# Altium project pale_sieve.PrjPcb
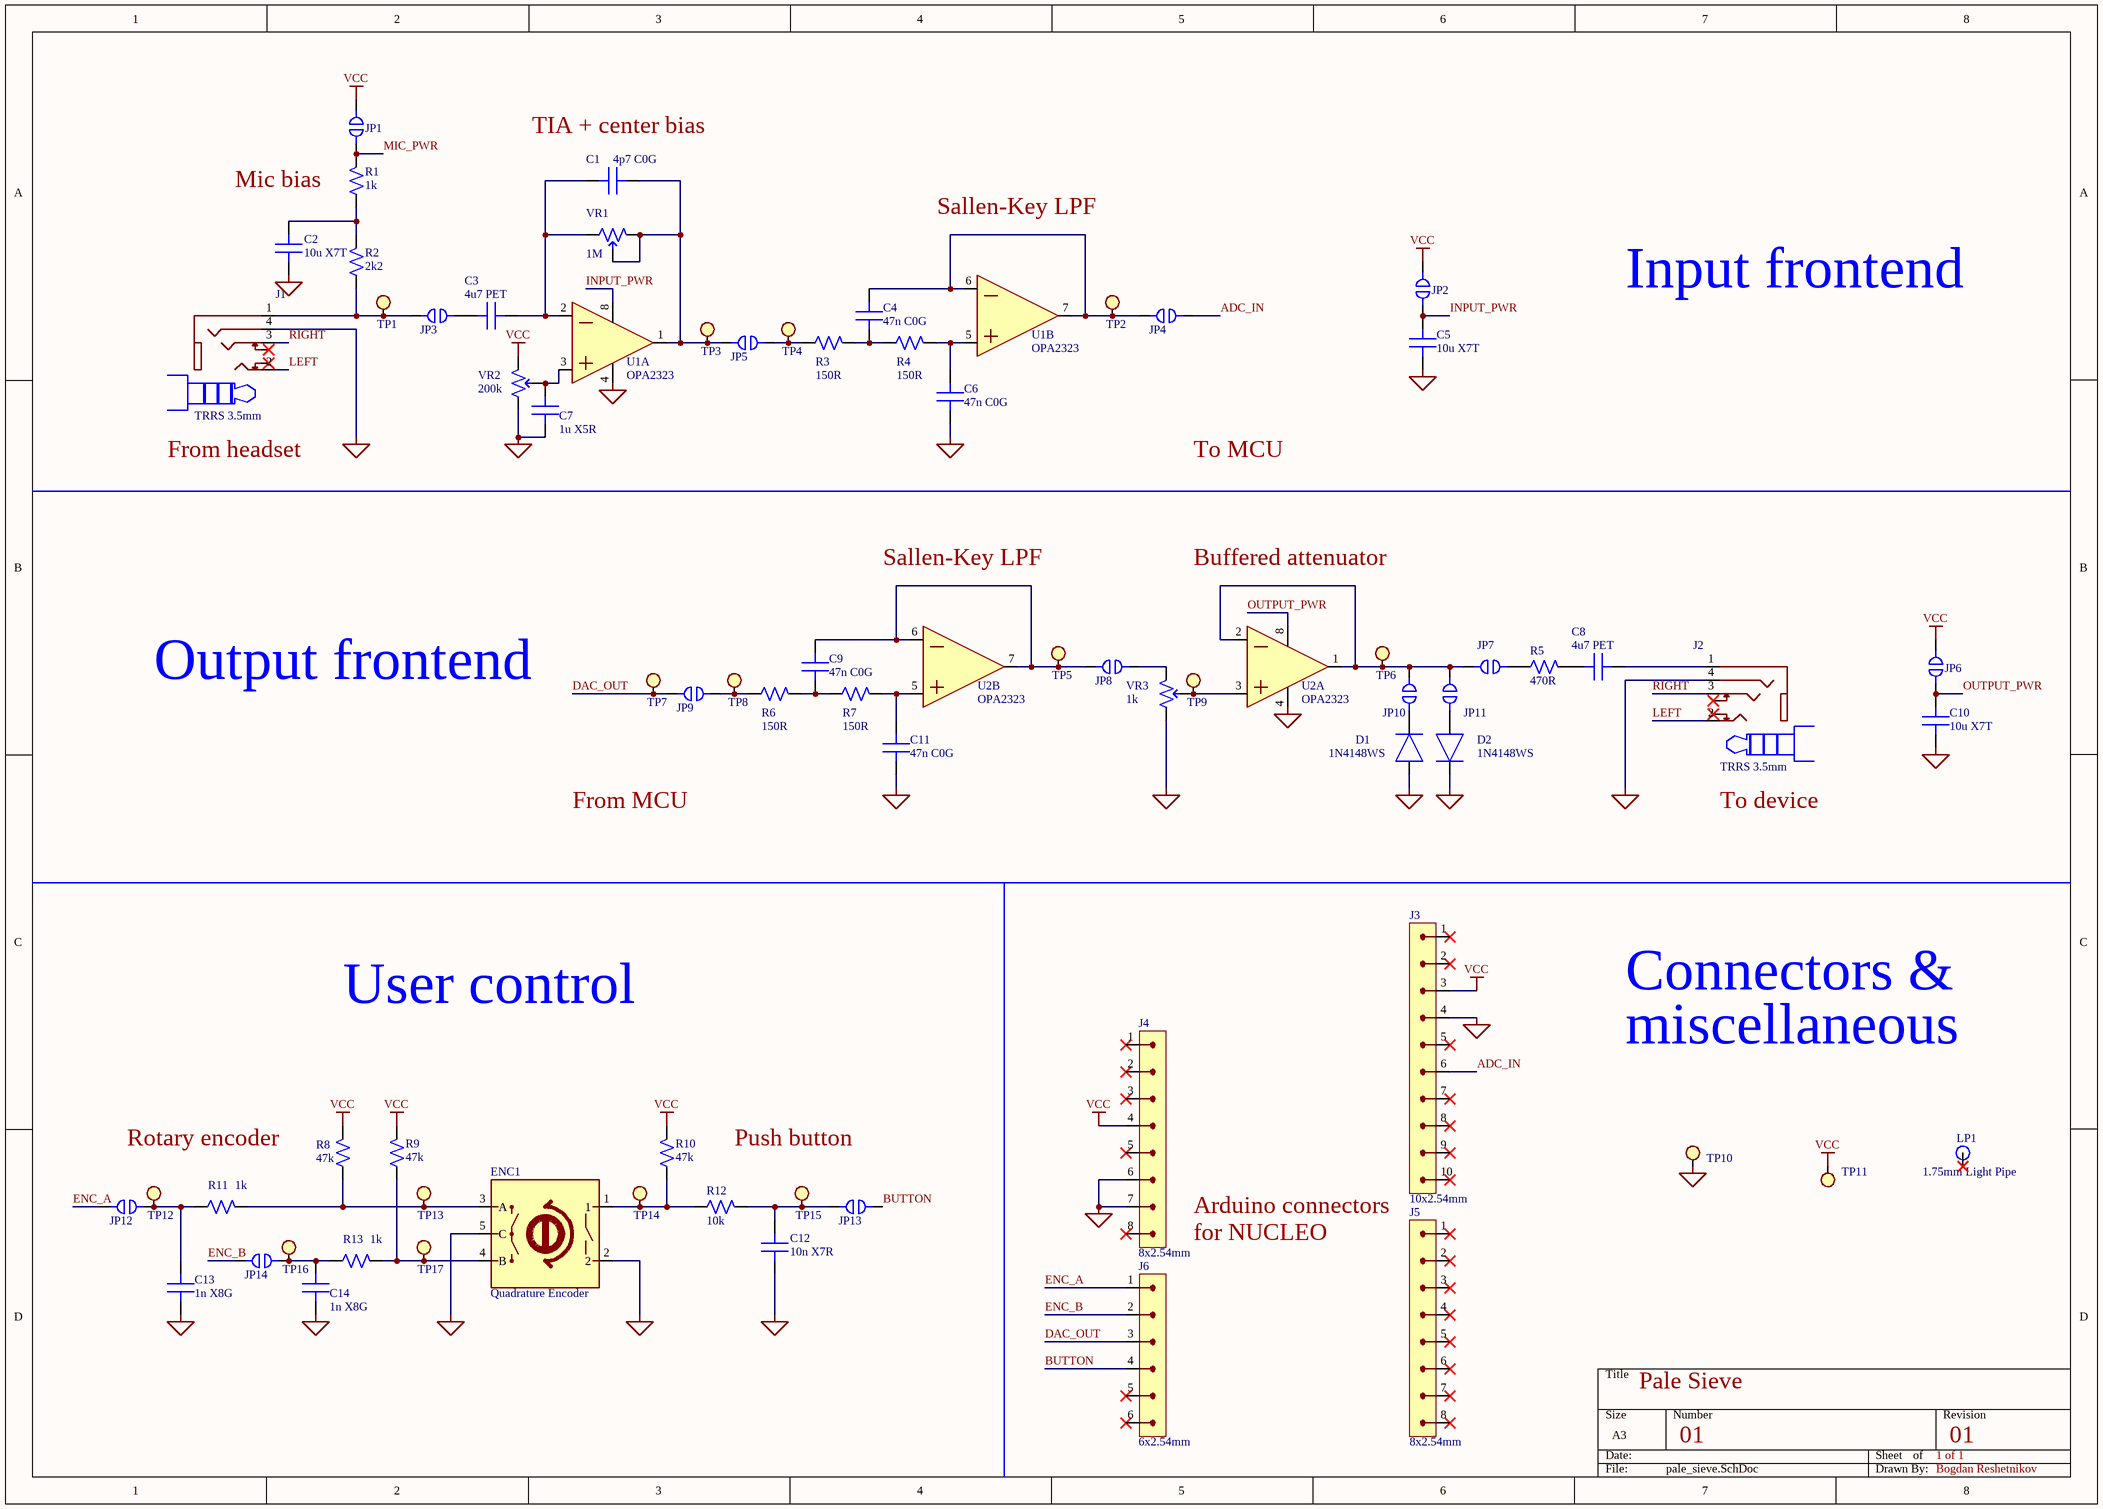
[diagram p0: pale_sieve.SchDoc]
1 sheet, 73 parts. Net scope: global (net labels, ports and power ports of the same name join across sheets).
Board file: pale_sieve.PcbDoc

## Sheet pale_sieve.SchDoc: Pale Sieve
size A3; Revision: 01; SheetNumber: 1; SheetTotal: 1

### Parts
C1  4p7 C0G  [C0603]
C2  10u X7T  [C0603]
C3  4u7 PET  [6054 WIMA]
C4  47n C0G  [C0805]
C5  10u X7T  [C0603]
C6  47n C0G  [C0805]
C7  1u X5R  [C0603]
C8  4u7 PET  [6054 WIMA]
C9  47n C0G  [C0805]
C10  10u X7T  [C0603]
C11  47n C0G  [C0805]
C12  10n X7R  [C0603]
C13  1n X8G  [C0603]
C14  1n X8G  [C0603]
D1  1N4148WS  [SOD-323]
D2  1N4148WS  [SOD-323]
ENC1  Quadrature Encoder  [PEC11L]
J1  TRRS 3.5mm  [SJ2-35894B-SMT]
J2  TRRS 3.5mm  [SJ2-35894B-SMT]
J3  10x2.54mm  [1X10 2.54MM]
J4  8x2.54mm  [1x8 2.54MM]
J5  8x2.54mm  [1x8 2.54MM]
J6  6x2.54mm  [1X6 2.54MM]
JP1  Normally open  [SB 1.0x1.5mm]  (value not drawn)
JP2  Normally open  [SB 1.0x1.5mm]  (value not drawn)
JP3  Normally open  [SB 1.0x1.5mm]  (value not drawn)
JP4  Normally open  [SB 1.0x1.5mm]  (value not drawn)
JP5  Normally open  [SB 1.0x1.5mm]  (value not drawn)
JP6  Normally open  [SB 1.0x1.5mm]  (value not drawn)
JP7  Normally open  [SB 1.0x1.5mm]  (value not drawn)
JP8  Normally open  [SB 1.0x1.5mm]  (value not drawn)
JP9  Normally open  [SB 1.0x1.5mm]  (value not drawn)
JP10  Normally open  [SB 1.0x1.5mm]  (value not drawn)
JP11  Normally open  [SB 1.0x1.5mm]  (value not drawn)
JP12  Normally open  [SB 1.0x1.5mm]  (value not drawn)
JP13  Normally open  [SB 1.0x1.5mm]  (value not drawn)
JP14  Normally open  [SB 1.0x1.5mm]  (value not drawn)
LP1  1.75mm Light Pipe  [PTH 1.75MM]
R1  1k  [R0603]
R2  2k2  [R0603]
R3  150R  [R0603]
R4  150R  [R0603]
R5  470R  [R0603]
R6  150R  [R0603]
R7  150R  [R0603]
R8  47k  [R0603]
R9  47k  [R0603]
R10  47k  [R0603]
R11  1k  [R0603]
R12  10k  [R0603]
R13  1k  [R0603]
TP1  PTH 0.75mm  [PTH 0.7MM]  (value not drawn)
TP2  PTH 0.75mm  [PTH 0.7MM]  (value not drawn)
TP3  PTH 0.75mm  [PTH 0.7MM]  (value not drawn)
TP4  PTH 0.75mm  [PTH 0.7MM]  (value not drawn)
TP5  PTH 0.75mm  [PTH 0.7MM]  (value not drawn)
TP6  PTH 0.75mm  [PTH 0.7MM]  (value not drawn)
TP7  PTH 0.75mm  [PTH 0.7MM]  (value not drawn)
TP8  PTH 0.75mm  [PTH 0.7MM]  (value not drawn)
TP9  PTH 0.75mm  [PTH 0.7MM]  (value not drawn)
TP10  PTH 0.75mm  [PTH 0.7MM]  (value not drawn)
TP11  PTH 0.75mm  [PTH 0.7MM]  (value not drawn)
TP12  PTH 0.75mm  [PTH 0.7MM]  (value not drawn)
TP13  PTH 0.75mm  [PTH 0.7MM]  (value not drawn)
TP14  PTH 0.75mm  [PTH 0.7MM]  (value not drawn)
TP15  PTH 0.75mm  [PTH 0.7MM]  (value not drawn)
TP16  PTH 0.75mm  [PTH 0.7MM]  (value not drawn)
TP17  PTH 0.75mm  [PTH 0.7MM]  (value not drawn)
U1  OPA2323  [SOIC-8 D]  (parts A,B of 2)
U2  OPA2323  [SOIC-8 D]  (parts A,B of 2)
VR1  1M  [TS53YL]
VR2  200k  [TS53YL]
VR3  1k  [TS53YL]

### Nets
GND: C2.1 C5.1 C6.1 C7.1 C10.1 C11.1 C12.1 C13.1 C14.1 D1.2 D2.1 ENC1.2 ENC1.5(C) J1.4 J2.4 J3.4 J4.6 J4.7 TP10.1 U1.4 U2.4 VR2.1 VR3.1
VCC: J3.3 J4.4 JP1.2 JP2.2 JP6.2 R8.2 R9.2 R10.2 TP11.1 VR2.3
ADC_IN: J3.6 JP4.2
BUTTON: J6.4 JP13.2
DAC_OUT: J6.3 JP9.1 TP7.1
ENC_A: J6.1 JP12.1
ENC_B: J6.2 JP14.1
INPUT_PWR: C5.2 JP2.1 U1.8
LEFT: J1.2 J2.2
MIC_PWR: JP1.1 R1.2
OUTPUT_PWR: C10.2 JP6.1 U2.8
RIGHT: J1.3 J2.3
NetC1_1: C1.1 C3.2 U1.2 VR1.3
NetC1_2: C1.2 JP5.1 TP3.1 U1.1 VR1.1 VR1.2
NetC2_2: C2.2 R1.1 R2.2
NetC3_1: C3.1 JP3.2
NetC4_1: C4.1 R3.2 R4.1
NetC4_2: C4.2 JP4.1 TP2.1 U1.6 U1.7
NetC6_2: C6.2 R4.2 U1.5
NetC7_2: C7.2 U1.3 VR2.2
NetC8_1: C8.1 R5.2
NetC8_2: C8.2 J2.1
NetC9_1: C9.1 R6.2 R7.1
NetC9_2: C9.2 JP8.1 TP5.1 U2.6 U2.7
NetC11_2: C11.2 R7.2 U2.5
NetC12_2: C12.2 JP13.1 R12.2 TP15.1
NetC13_2: C13.2 JP12.2 R11.1 TP12.1
NetC14_2: C14.2 JP14.2 R13.1 TP16.1
NetD1_1: D1.1 JP10.1
NetD2_2: D2.2 JP11.1
NetENC1_1: ENC1.1 R10.1 R12.1 TP14.1
NetENC1_3: ENC1.3(A) R8.1 R11.2 TP13.1
NetENC1_4: ENC1.4(B) R9.1 R13.2 TP17.1
NetJ1_1: J1.1 JP3.1 R2.1 TP1.1
NetJP5_2: JP5.2 R3.1 TP4.1
NetJP7_1: JP7.1 JP10.2 JP11.2 TP6.1 U2.1 U2.2
NetJP7_2: JP7.2 R5.1
NetJP8_2: JP8.2 VR3.3
NetJP9_2: JP9.2 R6.1 TP8.1
NetTP9_1: TP9.1 U2.3 VR3.2

Not connected (* = marked no-connect by the designer): J1 10* 11*; J2 10* 11*; J3 1* 2* 5* 7* 8* 9* 10*; J4 1* 2* 3* 5* 8*; J5 1* 2* 3* 4* 5* 6* 7* 8*; J6 5* 6*; LP1 1*

### Notes on the sheet
- (near C1) TIA + center bias
- Mic bias
- Sallen-Key LPF
- Input frontend
- From headset
- To MCU
- Buffered attenuator
- Output frontend
- From MCU
- To device
- User control
- Connectors &
- miscellaneous
- Rotary encoder
- Push button
- Arduino connectors
- for NUCLEO
- Pale Sieve
- 01
- 1 of 1
- Bogdan Reshetnikov

### Library data of the parts
C1 = 06035U4R7JAT2A: Multilayer Ceramic Capacitors MLCC - SMD/SMT 50V 4.7pF C0G 0603 5% Tol Ultra Low ESR; Manufacturer: Kyocera AVX; Supplier: Mouser; Supplier Part Number: 581-06035U4R7JAT2A; Manufacturer Part Number: 06035U4R7JAT2A; RoHS: Yes; Category: Ceramic Capacitors; Stock: 33815; Pricing: 1=0.39, 10=0.256, 50=0.256, 100=0.16, 1000=0.121, 10000=0.092 (USD); ComponentLink1URL: https://datasheet.ciiva.com/11551/useries-11551734.pdf?src-supplier=Avnet; ComponentLink1Description: https://datasheet.ciiva.com/11551/useries-11551734.pdf?src-supplier=Avnet; ComponentLink2URL: https://datasheet.ciiva.com/6265/useries-6265127.pdf?src-supplier=Digikey; ComponentLink2Description: https://datasheet.ciiva.com/6265/useries-6265127.pdf?src-supplier=Digikey
C2 C5 C10 = CGA3EDX7T1A106M080AU: Manufacturer: TDK; Supplier: Mouser; Supplier Part Number: 810-CGA3EDX7T1A106M0; Manufacturer Part Number: CGA3EDX7T1A106M080AU; RoHS: No; Category: Ceramic Capacitors; Stock: 910; Pricing: 1=0.49, 10=0.321, 50=0.321, 100=0.193, 1000=0.149, 10000=0.112 (USD)
C3 C8 = SMDTD04470YA00KS00: Film Capacitor, Polyethylene Terephthalate, 100V, 10% +Tol, 10% -Tol, 4.7uF, Surface Mount, 6054; Manufacturer: WIMA; Rated AC Voltage (URac): 63V; Supplier: Mouser; Supplier Part Number: 505-SMDTD04470YA00KS; Manufacturer Part Number: SMDTD04470YA00KS00; RoHS: Yes; Category: Film Capacitors; Stock: 606; Pricing: 1=2.93, 10=2.13, 50=1.96, 100=1.64, 1000=1.31, 10000=1.18 (USD); Pins: 2; Dielectric Material: Polyethylene; Case/Package: 6054; Terminal Finish: Tin; Min Operating Temperature: -55°C; Max Operating Temperature: 100°C; JESD-609 Code: e3; Value: 4.7uF; Capacitor Type: FILM; Tolerance  (fill in as +-): 10%; Package Style: SMTMeter; Packaging: Bulk; Tolerance (fill in as +-): 10%; Rated DC Voltage (URdc): 100V; Length: 15.3mm; Width: 13.7mm; Height: 7mm; Reach SVHC Compliant: Yes; RoHS Compliant: Yes; ComponentLink1URL: https://datasheet.ciiva.com:443/pdfs/VipMasterIC/IC/WIMA/WIMA-S-A0007419195/WIMA-S-A0007419195-1.pdf?src-supplier=IHS+Markit; ComponentLink1Description: https://datasheet.ciiva.com:443/pdfs/VipMasterIC/IC/WIMA/WIMA-S-A0007419195/WIMA-S-A0007419195-1.pdf?src-supplier=IHS+Markit; ComponentLink2URL: https://datasheet.ciiva.com/8034/1674204-8034651.pdf?src-supplier=Element14; ComponentLink2Description: https://datasheet.ciiva.com/8034/1674204-8034651.pdf?src-supplier=Element14
C4 C6 C9 C11 = C0805C473G3GECAUTO: Ceramic Capacitor, Multilayer, Ceramic, 25V, 2% +Tol, 2% -Tol, C0G, -/+30ppm/Cel TC, 0.047uF, Surface Mount, 0805; Manufacturer: KEMET; Supplier: Mouser; Supplier Part Number: 80-C0805C473G3GECAUT; Manufacturer Part Number: C0805C473G3GECAUTO; RoHS: Yes; Category: Ceramic Capacitors; Stock: 3931; Pricing: 1=0.86, 10=0.61, 50=0.61, 100=0.482, 1000=0.399, 10000=0.329 (USD); Pins: 2; Dielectric Material: Ceramic; Capacitor Type: Ceramic; Reach SVHC Compliant: Yes; RoHS Compliant: Yes; ComponentLink1URL: https://datasheet.ciiva.com:443/pdfs/VipMasterIC/IC/KEME/KEME-S-A0008958440/KEME-S-A0008958440-1.pdf?src-supplier=IHS+Markit; ComponentLink1Description: https://datasheet.ciiva.com:443/pdfs/VipMasterIC/IC/KEME/KEME-S-A0008958440/KEME-S-A0008958440-1.pdf?src-supplier=IHS+Markit; ComponentLink2URL: https://api.kemet.com/component-edge/download/datasheet/C0805C473G3GECAUTO.pdf?src-supplier=Digikey; ComponentLink2Description: https://api.kemet.com/component-edge/download/datasheet/C0805C473G3GECAUTO.pdf?src-supplier=Digikey
C7 = 0603YD105KAT2A: Ceramic Capacitor, Multilayer, Ceramic, 16V, 10% +Tol, 10% -Tol, X5R, 15% TC, 1uF, Surface Mount, 0603; Manufacturer: Kyocera AVX; Multilayer: Yes; Supplier: Mouser; Supplier Part Number: 581-0603YD105K; Manufacturer Part Number: 0603YD105KAT2A; RoHS: Yes; Category: Ceramic Capacitors; Stock: 78861; Pricing: 1=0.1, 10=0.054, 50=0.054, 100=0.039, 1000=0.028, 10000=0.014 (USD); Mounting Technology: Surface Mount; Pins: 2; Dielectric Material: Ceramic; Package Shape: Rectangular; Case/Package: 0603; Terminal Finish: Nickel; Min Operating Temperature: -55°C; Max Operating Temperature: 85°C; JESD-609 Code: e3; Value: 1uF; Capacitor Type: Ceramic; Tolerance  (fill in as +-): 10%; Package Style: SMTMeter; Packaging: Tape and Reel; Tolerance (fill in as +-): 10%; Rated DC Voltage (URdc): 16V; Temperature Characteristics Code: X5R; Termination: Wraparound; Length: 1.6mm; Width: 0.81mm; Height: 0.9mm; Reach SVHC Compliant: Yes; RoHS Compliant: Yes; ComponentLink1URL: https://datasheet.ciiva.com:443/pdfs/VipMasterIC/IC/AVXC/AVXC-S-A0009640604/AVXC-S-A0009640604-1.pdf?src-supplier=IHS+Markit; ComponentLink1Description: https://datasheet.ciiva.com:443/pdfs/VipMasterIC/IC/AVXC/AVXC-S-A0009640604/AVXC-S-A0009640604-1.pdf?src-supplier=IHS+Markit; ComponentLink2URL: https://datasheet.ciiva.com/34303/2012654-34303835.pdf?src-supplier=Jameco; ComponentLink2Description: https://datasheet.ciiva.com/34303/2012654-34303835.pdf?src-supplier=Jameco; ComponentLink3URL: https://datasheet.ciiva.com/11788/0900766b80def1a5-11788563.pdf?src-supplier=Rs; ComponentLink3Description: https://datasheet.ciiva.com/11788/0900766b80def1a5-11788563.pdf?src-supplier=Rs; ComponentLink4URL: https://datasheet.ciiva.com/150/cx5r-150393.pdf?src-supplier=Digikey; ComponentLink4Description: https://datasheet.ciiva.com/150/cx5r-150393.pdf?src-supplier=Digikey; ComponentLink5URL: https://datasheet.ciiva.com/5412/cx5r-5412550.pdf?src-supplier=Mouser; ComponentLink5Description: https://datasheet.ciiva.com/5412/cx5r-5412550.pdf?src-supplier=Mouser; ComponentLink6URL: https://datasheet.ciiva.com/14586/70001028-14586715.pdf?src-supplier=Allied+Electronics; ComponentLink6Description: https://datasheet.ciiva.com/14586/70001028-14586715.pdf?src-supplier=Allied+Electronics; ComponentLink7URL: https://datasheet.ciiva.com/14590/70001028-14590632.pdf?src-supplier=Allied+Electronics; ComponentLink7Description: https://datasheet.ciiva.com/14590/70001028-14590632.pdf?src-supplier=Allied+Electronics; ComponentLink8URL: https://datasheet.ciiva.com/2987/cx5r-2987890.pdf?src-supplier=Avnet; ComponentLink8Description: https://datasheet.ciiva.com/2987/cx5r-2987890.pdf?src-supplier=Avnet; ComponentLink9URL: https://datasheet.ciiva.com/1458/84508-1458137.pdf?src-supplier=Element14; ComponentLink9Description: https://datasheet.ciiva.com/1458/84508-1458137.pdf?src-supplier=Element14; ComponentLink10URL: https://datasheet.ciiva.com/1458/84508-1458138.pdf?src-supplier=Element14; ComponentLink10Description: https://datasheet.ciiva.com/1458/84508-1458138.pdf?src-supplier=Element14; ComponentLink11URL: https://datasheet.ciiva.com/150/cx5r-150392.pdf?src-supplier=Digikey; ComponentLink11Description: https://datasheet.ciiva.com/150/cx5r-150392.pdf?src-supplier=Digikey; ComponentLink12URL: https://datasheet.ciiva.com/150/cx5r-150394.pdf?src-supplier=Digikey; ComponentLink12Description: https://datasheet.ciiva.com/150/cx5r-150394.pdf?src-supplier=Digikey
C12 = GCM188R71H103KA37J: Ceramic Capacitor, Multilayer, Ceramic, 50V, 10% +Tol, 10% -Tol, X7R, 15% TC, 0.01uF, Surface Mount, 0603; Manufacturer: Murata; Value: 10nF; Multilayer: Yes; Reference Standard: AEC-Q200; Supplier: Mouser; Supplier Part Number: 81-GCM188R71H103KA7J; Manufacturer Part Number: GCM188R71H103KA37J; RoHS: Yes; Category: Ceramic Capacitors; Stock: 4285681; Pricing: 1=0.12, 10=0.07, 50=0.07, 100=0.043, 1000=0.03, 10000=0.019 (USD); Mounting Technology: Surface Mount; Pins: 2; Dielectric Material: Ceramic; Package Shape: Rectangular; Case/Package: 0603; Terminal Finish: Nickel; Min Operating Temperature: -55°C; Max Operating Temperature: 125°C; JESD-609 Code: e3; Capacitor Type: Ceramic; Tolerance  (fill in as +-): 10%; Package Style: SMTMeter; Packaging: Tape and Reel; Tolerance (fill in as +-): 10%; Rated DC Voltage (URdc): 50V; Temperature Characteristics Code: X7R; Termination: Wraparound; Length: 1.6mm; Width: 0.8mm; Height: 0.9mm; Reach SVHC Compliant: Yes; RoHS Compliant: Yes; ComponentLink1URL: https://datasheet.ciiva.com:443/pdfs/VipMasterIC/IC/MURE/MURE-S-A0004362469/MURE-S-A0004362747-1.pdf?src-supplier=IHS+Markit; ComponentLink1Description: https://datasheet.ciiva.com:443/pdfs/VipMasterIC/IC/MURE/MURE-S-A0004362469/MURE-S-A0004362747-1.pdf?src-supplier=IHS+Markit; ComponentLink2URL: http://components.arrow.com/part/dataview/46582708S9924635N2606?src-supplier=Arrow+Electronics; ComponentLink2Description: http://components.arrow.com/part/dataview/46582708S9924635N2606?src-supplier=Arrow+Electronics; ComponentLink3URL: http://www.mouser.com/ds/2/281/c03e-806517.pdf?src-supplier=Mouser; ComponentLink3Description: http://www.mouser.com/ds/2/281/c03e-806517.pdf?src-supplier=Mouser; ComponentLink4URL: https://psearch.en.murata.com/capacitor/product/GCM188R71H103KA37%23.pdf?src-supplier=Digikey; ComponentLink4Description: https://psearch.en.murata.com/capacitor/product/GCM188R71H103KA37%23.pdf?src-supplier=Digikey; ComponentLink5URL: https://datasheet.octopart.com/GCM188R71H103KA37J-Murata-datasheet-41571772.pdf?src-supplier=Future+Electronics; ComponentLink5Description: https://datasheet.octopart.com/GCM188R71H103KA37J-Murata-datasheet-41571772.pdf?src-supplier=Future+Electronics
C13 C14 = C0603C102J2TACAUTO: Manufacturer: KEMET; Supplier: Mouser; Supplier Part Number: 80-C0603C102J2TAUTO; Manufacturer Part Number: C0603C102J2TACAUTO; RoHS: No; Stock: 6659; Pricing: 1=0.55, 10=0.357, 50=0.357, 100=0.252, 1000=0.197, 10000=0.149 (USD)
D1 D2 = 1N4148WS: Rectifier Diode, 1 Phase, 1 Element, 0.15A, 100V V(RRM), Silicon; Manufacturer: ON Semiconductor / Fairchild; Package Body Material: Plastic; Number of Elements: 1; Max Output current: 150mA; Reverse Recovery Time-Max: 0.004us; Forward Voltage: 1V; Qualification Status: Not Qualified; Supplier: Mouser; Supplier Part Number: 512-1N4148WS; Manufacturer Part Number: 1N4148WS; RoHS: Yes; Category: Rectifier Diodes; Stock: 1099354; Pricing: 1=0.11, 10=0.066, 50=0.066, 100=0.062, 1000=0.04, 10000=0.019 (USD); Pins: 2; Diode Element Material: SILICON; Package Shape: Rectangular; Max Operating Temperature: 150°C; Diode Type: RECTIFIER; JESD-30 Code: R-PDSO-F2; Package Style: SMALL OUTLINEMeter; Rep Pk Reverse Voltage-Max: 100V; Surface Mount: Yes; Terminal Form: Flat; Terminal Position: DUAL; Moisture Sensitivity Level: 1; Reach SVHC Compliant: Yes; RoHS Compliant: Yes; ComponentLink1URL: https://datasheet.ciiva.com:443/pdfs/VipMasterIC/IC/ONSM/ONSM-S-A0003392874/ONSM-S-A0003585195-1.pdf?src-supplier=IHS+Markit; ComponentLink1Description: https://datasheet.ciiva.com:443/pdfs/VipMasterIC/IC/ONSM/ONSM-S-A0003392874/ONSM-S-A0003585195-1.pdf?src-supplier=IHS+Markit
ENC1 = PEC11L-4120F-S0020: Rotary Position Encoder; Manufacturer: Bourns; Supplier: Mouser; Supplier Part Number: 652-PEC11L4120FS0020; Manufacturer Part Number: PEC11L-4120F-S0020; RoHS: Yes; Category: Encoders; Stock: 1506; Pricing: 1=2.32, 10=1.81, 50=1.81, 100=1.72, 1000=1.49, 10000=1.3 (USD); Optoelectronic Device Type: ROTARY POSITION ENCODER; Reach SVHC Compliant: Yes; RoHS Compliant: Yes; ComponentLink1URL: https://datasheet.ciiva.com:443/pdfs/VipMasterIC/IC/BOUR/BOUR-S-A0009552335/BOUR-S-A0009552335-1.pdf?src-supplier=IHS+Markit; ComponentLink1Description: https://datasheet.ciiva.com:443/pdfs/VipMasterIC/IC/BOUR/BOUR-S-A0009552335/BOUR-S-A0009552335-1.pdf?src-supplier=IHS+Markit; ComponentLink2URL: https://datasheet.ciiva.com/29891/pec11l-29891433.pdf?src-supplier=Avnet; ComponentLink2Description: https://datasheet.ciiva.com/29891/pec11l-29891433.pdf?src-supplier=Avnet; ComponentLink3URL: https://datasheet.ciiva.com/24006/pec11l-74340-24006965.pdf?src-supplier=Mouser; ComponentLink3Description: https://datasheet.ciiva.com/24006/pec11l-74340-24006965.pdf?src-supplier=Mouser; ComponentLink4URL: https://datasheet.ciiva.com/45927/1272pec11l-45927899.pdf?src-supplier=Onlinecomponents.com; ComponentLink4Description: https://datasheet.ciiva.com/45927/1272pec11l-45927899.pdf?src-supplier=Onlinecomponents.com
J1 J2 = SJ2-35894B-SMT-TR: 3.5 mm, Stereo, Right Angle, Surface Mount (SMT), Audio Jack Connector; Manufacturer: Same Sky; Supplier: Mouser; Supplier Part Number: 490-SJ2-35894BSMT-TR; Manufacturer Part Number: SJ2-35894B-SMT-TR; RoHS: No; Stock: 8459; Pricing: 1=1.3, 10=0.92, 50=0.92, 100=0.798, 1000=0.658, 10000=0.631 (USD); ComponentLink1URL: https://www.cuidevices.com/product/resource/digikeypdf/sj2-3589x-smt.pdf?src-supplier=Digikey; ComponentLink1Description: https://www.cuidevices.com/product/resource/digikeypdf/sj2-3589x-smt.pdf?src-supplier=Digikey
JP1-JP14 = SolderBridge
LP1 = LightPipe
R1 R11 R13 = CRCW06031K00FKEI: Fixed Resistor, Metal Glaze/thick Film, 0.1W, 1000ohm, 75V, 1% +/-Tol, 100ppm/Cel, Surface Mount, 0603; Manufacturer: Vishay; Power: 100mW; Rated Temperature: 70°C; Value: 1kR; Temperature Coefficient (ppm/Cel): 100; Package Height: 0.45mm; Package Length: 1.55mm; Package Width: 0.85mm; Reference Standard: AEC-Q200; Supplier: Mouser; Supplier Part Number: 71-CRCW06031K00FKEI; Manufacturer Part Number: CRCW06031K00FKEI; RoHS: Yes; Category: Chip SMD Resistors; Stock: 93678; Pricing: 1=0.12, 10=0.029, 50=0.029, 100=0.016, 1000=0.016, 10000=0.013 (USD); Mounting Technology: Surface Mount; Pins: 2; Package Shape: Rectangular; Case/Package: 0603; Terminal Finish: Nickel; Min Operating Temperature: -55°C; Max Operating Temperature: 155°C; Tolerance: 1%; JESD-609 Code: e3; Resistor Type: FIXED RESISTOR; Construction: Chip; Packaging: Tape and Reel; Technology: METAL GLAZE/THICK FILM; Termination: Wraparound; Working Voltage: 75V; Reach SVHC Compliant: Yes; RoHS Compliant: Yes; ComponentLink1URL: https://datasheet.ciiva.com:443/pdfs/VipMasterIC/IC/VISH/VISH-S-A0007266705/VISH-S-A0007266705-1.pdf?src-supplier=IHS+Markit; ComponentLink1Description: https://datasheet.ciiva.com:443/pdfs/VipMasterIC/IC/VISH/VISH-S-A0007266705/VISH-S-A0007266705-1.pdf?src-supplier=IHS+Markit
R2 = CRCW06032K20FKEA: Fixed Resistor, Metal Glaze/thick Film, 0.1W, 2200ohm, 75V, 1% +/-Tol, 100ppm/Cel, Surface Mount, 0603; Manufacturer: Vishay; Power: 100mW; Value: 2.2kR; Temperature Coefficient (ppm/Cel): 100; Rated Temperature: 70°C; Package Height: 0.45mm; Package Length: 1.55mm; Package Width: 0.85mm; Reference Standard: AEC-Q200; Supplier: Mouser; Supplier Part Number: 71-CRCW0603-2.2K-E3; Manufacturer Part Number: CRCW06032K20FKEA; RoHS: Yes; Category: Chip SMD Resistors; Stock: 270161; Pricing: 1=0.1, 10=0.028, 50=0.028, 100=0.015, 1000=0.008, 10000=0.004 (USD); Mounting Technology: Surface Mount; Pins: 2; Case/Package: 0603; Terminal Finish: Nickel; Package Shape: Rectangular; Min Operating Temperature: -55°C; Max Operating Temperature: 155°C; Tolerance: 1%; JESD-609 Code: e3; Resistor Type: FIXED RESISTOR; Construction: Chip; Packaging: Tape and Reel; Technology: METAL GLAZE/THICK FILM; Working Voltage: 75V; Termination: Wraparound; Reach SVHC Compliant: Yes; RoHS Compliant: Yes; ComponentLink1URL: https://datasheet.ciiva.com:443/pdfs/VipMasterIC/IC/VISH/VISH-S-A0007266705/VISH-S-A0007266705-1.pdf?src-supplier=IHS+Markit; ComponentLink1Description: https://datasheet.ciiva.com:443/pdfs/VipMasterIC/IC/VISH/VISH-S-A0007266705/VISH-S-A0007266705-1.pdf?src-supplier=IHS+Markit
R3 R4 R6 R7 = CRCW0603150RFKEA: Fixed Resistor, Metal Glaze/thick Film, 0.1W, 150ohm, 75V, 1% +/-Tol, 100ppm/Cel, Surface Mount, 0603; Manufacturer: Vishay; Power: 100mW; Temperature Coefficient (ppm/Cel): 100; Rated Temperature: 70°C; Package Height: 0.45mm; Package Length: 1.55mm; Package Width: 0.85mm; Reference Standard: AEC-Q200; Supplier: Mouser; Supplier Part Number: 71-CRCW0603-150-E3; Manufacturer Part Number: CRCW0603150RFKEA; RoHS: Yes; Category: Chip SMD Resistors; Stock: 275413; Pricing: 1=0.1, 10=0.02, 50=0.02, 100=0.014, 1000=0.008, 10000=0.004 (USD); Mounting Technology: Surface Mount; Pins: 2; Case/Package: 0603; Terminal Finish: Nickel; Package Shape: Rectangular; Min Operating Temperature: -55°C; Max Operating Temperature: 155°C; Tolerance: 1%; JESD-609 Code: e3; Resistor Type: FIXED RESISTOR; Construction: Chip; Packaging: Tape and Reel; Value: 150R; Technology: METAL GLAZE/THICK FILM; Working Voltage: 75V; Termination: Wraparound; Reach SVHC Compliant: Yes; RoHS Compliant: Yes; ComponentLink1URL: https://datasheet.ciiva.com:443/pdfs/VipMasterIC/IC/VISH/VISH-S-A0007266705/VISH-S-A0007266705-1.pdf?src-supplier=IHS+Markit; ComponentLink1Description: https://datasheet.ciiva.com:443/pdfs/VipMasterIC/IC/VISH/VISH-S-A0007266705/VISH-S-A0007266705-1.pdf?src-supplier=IHS+Markit; ComponentLink2URL: https://datasheet.ciiva.com/11808/0900766b80d98afc-11808649.pdf?src-supplier=Rs; ComponentLink2Description: https://datasheet.ciiva.com/11808/0900766b80d98afc-11808649.pdf?src-supplier=Rs; ComponentLink3URL: https://datasheet.ciiva.com/26316/fld-crcw-e3-data-en-26316570.pdf?src-supplier=Distrelec; ComponentLink3Description: https://datasheet.ciiva.com/26316/fld-crcw-e3-data-en-26316570.pdf?src-supplier=Distrelec; ComponentLink4URL: https://datasheet.ciiva.com/2465/dcrcwe3-2465574.pdf?src-supplier=Digikey; ComponentLink4Description: https://datasheet.ciiva.com/2465/dcrcwe3-2465574.pdf?src-supplier=Digikey; ComponentLink5URL: https://datasheet.ciiva.com/2465/dcrcwe3-2465575.pdf?src-supplier=Digikey; ComponentLink5Description: https://datasheet.ciiva.com/2465/dcrcwe3-2465575.pdf?src-supplier=Digikey; ComponentLink6URL: https://datasheet.ciiva.com/2465/dcrcwe3-2465573.pdf?src-supplier=Digikey; ComponentLink6Description: https://datasheet.ciiva.com/2465/dcrcwe3-2465573.pdf?src-supplier=Digikey; ComponentLink7URL: https://datasheet.ciiva.com/7777/1697337-7777547.pdf?src-supplier=Element14; ComponentLink7Description: https://datasheet.ciiva.com/7777/1697337-7777547.pdf?src-supplier=Element14; ComponentLink8URL: https://datasheet.ciiva.com/16755/70201119-16755595.pdf?src-supplier=Allied+Electronics; ComponentLink8Description: https://datasheet.ciiva.com/16755/70201119-16755595.pdf?src-supplier=Allied+Electronics; ComponentLink9URL: https://datasheet.ciiva.com/16761/70201119-16761055.pdf?src-supplier=Allied+Electronics; ComponentLink9Description: https://datasheet.ciiva.com/16761/70201119-16761055.pdf?src-supplier=Allied+Electronics; ComponentLink10URL: https://datasheet.ciiva.com/5541/dcrcwe3-109170-5541864.pdf?src-supplier=Mouser; ComponentLink10Description: https://datasheet.ciiva.com/5541/dcrcwe3-109170-5541864.pdf?src-supplier=Mouser
R5 = CRCW0603470RFKEC: Fixed Resistor, Metal Glaze/thick Film, 0.1W, 470ohm, 75V, 1% +/-Tol, 100ppm/Cel, Surface Mount, 0603; Manufacturer: Vishay; Power: 100mW; Rated Temperature: 70°C; Temperature Coefficient (ppm/Cel): 100; Package Height: 0.45mm; Package Length: 1.55mm; Package Width: 0.85mm; Reference Standard: AEC-Q200; Supplier: Mouser; Supplier Part Number: 71-CRCW0603470RFKEC; Manufacturer Part Number: CRCW0603470RFKEC; RoHS: Yes; Category: Chip SMD Resistors; Stock: 49691; Pricing: 1=0.1, 10=0.017, 50=0.017, 100=0.017, 1000=0.017, 10000=0.017 (USD); Mounting Technology: Surface Mount; Pins: 2; Package Shape: Rectangular; Case/Package: 0603; Terminal Finish: Nickel; Min Operating Temperature: -55°C; Max Operating Temperature: 155°C; Tolerance: 1%; JESD-609 Code: e3; Resistor Type: FIXED RESISTOR; Construction: Chip; Packaging: Tape and Reel; Value: 470R; Technology: METAL GLAZE/THICK FILM; Termination: Wraparound; Working Voltage: 75V; Reach SVHC Compliant: Yes; RoHS Compliant: Yes; ComponentLink1URL: https://datasheet.ciiva.com:443/pdfs/VipMasterIC/IC/VISH/VISH-S-A0007266705/VISH-S-A0007266705-1.pdf?src-supplier=IHS+Markit; ComponentLink1Description: https://datasheet.ciiva.com:443/pdfs/VipMasterIC/IC/VISH/VISH-S-A0007266705/VISH-S-A0007266705-1.pdf?src-supplier=IHS+Markit; ComponentLink2URL: http://www.vishay.com/docs/20035/dcrcwe3.pdf?src-supplier=Digikey; ComponentLink2Description: http://www.vishay.com/docs/20035/dcrcwe3.pdf?src-supplier=Digikey; ComponentLink3URL: https://datasheet.octopart.com/CRCW0603470RFKEC-Vishay-datasheet-62316122.pdf?src-supplier=Future+Electronics; ComponentLink3Description: https://datasheet.octopart.com/CRCW0603470RFKEC-Vishay-datasheet-62316122.pdf?src-supplier=Future+Electronics
R8-R10 = CRCW060347K0FKEA: Fixed Resistor, Metal Glaze/thick Film, 0.1W, 47000ohm, 75V, 1% +/-Tol, 100ppm/Cel, Surface Mount, 0603; Manufacturer: Vishay; Power: 100mW; Value: 47kR; Temperature Coefficient (ppm/Cel): 100; Rated Temperature: 70°C; Package Height: 0.45mm; Package Length: 1.55mm; Package Width: 0.85mm; Reference Standard: AEC-Q200; Supplier: Mouser; Supplier Part Number: 71-CRCW0603-47K-E3; Manufacturer Part Number: CRCW060347K0FKEA; RoHS: Yes; Category: Chip SMD Resistors; Stock: 182851; Pricing: 1=0.1, 10=0.028, 50=0.028, 100=0.015, 1000=0.008, 10000=0.004 (USD); Mounting Technology: Surface Mount; Pins: 2; Case/Package: 0603; Terminal Finish: Nickel; Package Shape: Rectangular; Min Operating Temperature: -55°C; Max Operating Temperature: 155°C; Tolerance: 1%; JESD-609 Code: e3; Resistor Type: FIXED RESISTOR; Construction: Chip; Packaging: Tape and Reel; Technology: METAL GLAZE/THICK FILM; Working Voltage: 75V; Termination: Wraparound; Reach SVHC Compliant: Yes; RoHS Compliant: Yes; ComponentLink1URL: https://datasheet.ciiva.com:443/pdfs/VipMasterIC/IC/VISH/VISH-S-A0007266705/VISH-S-A0007266705-1.pdf?src-supplier=IHS+Markit; ComponentLink1Description: https://datasheet.ciiva.com:443/pdfs/VipMasterIC/IC/VISH/VISH-S-A0007266705/VISH-S-A0007266705-1.pdf?src-supplier=IHS+Markit; ComponentLink2URL: https://datasheet.ciiva.com/11808/0900766b80d98afc-11808694.pdf?src-supplier=Rs; ComponentLink2Description: https://datasheet.ciiva.com/11808/0900766b80d98afc-11808694.pdf?src-supplier=Rs
R12 = CRCW060310K0FKEA: Fixed Resistor, Metal Glaze/thick Film, 0.1W, 10000ohm, 75V, 1% +/-Tol, 100ppm/Cel, Surface Mount, 0603; Manufacturer: Vishay; Power: 100mW; Value: 10kR; Temperature Coefficient (ppm/Cel): 100; Rated Temperature: 70°C; Package Height: 0.45mm; Package Length: 1.55mm; Package Width: 0.85mm; Reference Standard: AEC-Q200; Supplier: Mouser; Supplier Part Number: 71-CRCW0603-10K-E3; Manufacturer Part Number: CRCW060310K0FKEA; RoHS: Yes; Category: Chip SMD Resistors; Stock: 2181326; Pricing: 1=0.1, 10=0.031, 50=0.031, 100=0.015, 1000=0.008, 10000=0.004 (USD); Mounting Technology: Surface Mount; Pins: 2; Case/Package: 0603; Terminal Finish: Nickel; Package Shape: Rectangular; Min Operating Temperature: -55°C; Max Operating Temperature: 155°C; Tolerance: 1%; JESD-609 Code: e3; Resistor Type: FIXED RESISTOR; Construction: Chip; Packaging: Tape and Reel; Technology: METAL GLAZE/THICK FILM; Working Voltage: 75V; Termination: Wraparound; Reach SVHC Compliant: Yes; RoHS Compliant: Yes; ComponentLink1URL: https://datasheet.ciiva.com:443/pdfs/VipMasterIC/IC/VISH/VISH-S-A0007266705/VISH-S-A0007266705-1.pdf?src-supplier=IHS+Markit; ComponentLink1Description: https://datasheet.ciiva.com:443/pdfs/VipMasterIC/IC/VISH/VISH-S-A0007266705/VISH-S-A0007266705-1.pdf?src-supplier=IHS+Markit; ComponentLink2URL: https://datasheet.ciiva.com/11809/0900766b80d98afc-11809037.pdf?src-supplier=Rs; ComponentLink2Description: https://datasheet.ciiva.com/11809/0900766b80d98afc-11809037.pdf?src-supplier=Rs; ComponentLink3URL: https://datasheet.ciiva.com/46385/1697337-46385498.pdf?src-supplier=Element14; ComponentLink3Description: https://datasheet.ciiva.com/46385/1697337-46385498.pdf?src-supplier=Element14; ComponentLink4URL: https://datasheet.ciiva.com/2465/dcrcwe3-2465514.pdf?src-supplier=Digikey; ComponentLink4Description: https://datasheet.ciiva.com/2465/dcrcwe3-2465514.pdf?src-supplier=Digikey; ComponentLink5URL: https://datasheet.ciiva.com/2465/dcrcwe3-2465515.pdf?src-supplier=Digikey; ComponentLink5Description: https://datasheet.ciiva.com/2465/dcrcwe3-2465515.pdf?src-supplier=Digikey; ComponentLink6URL: https://datasheet.ciiva.com/2465/dcrcwe3-2465513.pdf?src-supplier=Digikey; ComponentLink6Description: https://datasheet.ciiva.com/2465/dcrcwe3-2465513.pdf?src-supplier=Digikey; ComponentLink7URL: https://datasheet.ciiva.com/5543/dcrcwe3-109170-5543001.pdf?src-supplier=Mouser; ComponentLink7Description: https://datasheet.ciiva.com/5543/dcrcwe3-109170-5543001.pdf?src-supplier=Mouser; ComponentLink8URL: https://datasheet.ciiva.com/3256/dcrcwe3-3256940.pdf?src-supplier=Avnet; ComponentLink8Description: https://datasheet.ciiva.com/3256/dcrcwe3-3256940.pdf?src-supplier=Avnet; ComponentLink9URL: https://datasheet.ciiva.com/16209/dcrcwe3-16209164.pdf?src-supplier=Future+Electronics; ComponentLink9Description: https://datasheet.ciiva.com/16209/dcrcwe3-16209164.pdf?src-supplier=Future+Electronics; ComponentLink10URL: https://datasheet.ciiva.com/3256/dcrcwe3-3256939.pdf?src-supplier=Avnet; ComponentLink10Description: https://datasheet.ciiva.com/3256/dcrcwe3-3256939.pdf?src-supplier=Avnet; ComponentLink11URL: https://datasheet.ciiva.com/26314/fld-crcw-e3-data-en-26314749.pdf?src-supplier=Distrelec; ComponentLink11Description: https://datasheet.ciiva.com/26314/fld-crcw-e3-data-en-26314749.pdf?src-supplier=Distrelec; ComponentLink12URL: https://datasheet.ciiva.com/16719/70201119-16719704.pdf?src-supplier=Allied+Electronics; ComponentLink12Description: https://datasheet.ciiva.com/16719/70201119-16719704.pdf?src-supplier=Allied+Electronics; ComponentLink13URL: https://datasheet.ciiva.com/16754/70201119-16754710.pdf?src-supplier=Allied+Electronics; ComponentLink13Description: https://datasheet.ciiva.com/16754/70201119-16754710.pdf?src-supplier=Allied+Electronics
TP1-TP17 = TestPoint
U1 U2 = OPA2323IDR: Manufacturer: Texas Instruments; Supplier: Mouser; Supplier Part Number: 595-OPA2323IDR; Manufacturer Part Number: OPA2323IDR; RoHS: No; Stock: 5343; Pricing: 1=1.63, 10=1.1, 50=0.974, 100=0.778, 1000=0.411, 10000=0.393 (USD)
VR1 = TS53YL105MR10: Trimmer, Cermet, 0.04W, 1000000ohm, 200V, 20% +/-Tol, 100ppm/Cel, 1 Turn(s); Manufacturer: Vishay Sfernice; Actuator Orientation: Vertical; Actuator Type: SCREW; Number of Turns: 1; Power: 250mW; Rated Temperature: 70°C; Value: 1MR; Resistance Law: Linear; Rotational Angle: 220°; Temperature Coefficient (ppm/Cel): -100,100; Package Height: 2.7mm; Package Length: 5mm; Supplier: Mouser; Supplier Part Number: 72-TS53YL-1M; Manufacturer Part Number: TS53YL105MR10; RoHS: Yes; Category: Variable Resistors and Potentiometers; Stock: 577; Pricing: 1=2.72, 10=2.03, 50=2.03, 100=1.8, 1000=1.33, 10000=1.32 (USD); Mounting Technology: Surface Mount; Pins: 3; Package Shape: Rectangular; Case/Package: 2020; Terminal Finish: Tin; Min Operating Temperature: -55°C; Max Operating Temperature: 125°C; Tolerance: 20%; JESD-609 Code: e3; Resistor Type: TRIMMER; Construction: Trimmer; Packaging: Tape and Reel; Technology: CERMET; Termination: Gull Wing; Working Voltage: 200V; Package Width: 5mm; Reach SVHC Compliant: Yes; RoHS Compliant: Yes; ComponentLink1URL: https://datasheet.ciiva.com:443/pdfs/VipMasterIC/IC/VISH/VISH-S-A0007084328/VISH-S-A0007084328-1.pdf?src-supplier=IHS+Markit; ComponentLink1Description: https://datasheet.ciiva.com:443/pdfs/VipMasterIC/IC/VISH/VISH-S-A0007084328/VISH-S-A0007084328-1.pdf?src-supplier=IHS+Markit; ComponentLink2URL: https://datasheet.ciiva.com/8699/ts53y-8699175.pdf?src-supplier=Avnet; ComponentLink2Description: https://datasheet.ciiva.com/8699/ts53y-8699175.pdf?src-supplier=Avnet
VR2 = TS53YL204MR10: Trimmer, Cermet, 0.2W, 200000ohm, 200V, 20% +/-Tol, 100ppm/Cel, 1 Turn(s); Manufacturer: Vishay Sfernice; Actuator Orientation: Vertical; Actuator Type: SCREW; Number of Turns: 1; Power: 250mW; Rated Temperature: 70°C; Value: 200kR; Resistance Law: Linear; Rotational Angle: 220°; Temperature Coefficient (ppm/Cel): -100,100; Package Height: 2.7mm; Package Length: 5mm; Supplier: Mouser; Supplier Part Number: 72-TS53YL-200K; Manufacturer Part Number: TS53YL204MR10; RoHS: Yes; Category: Variable Resistors and Potentiometers; Stock: 1294; Pricing: 1=2.72, 10=2.29, 50=2.19, 100=1.9, 1000=1.56, 10000=1.34 (USD); Mounting Technology: Surface Mount; Pins: 3; Package Shape: Rectangular; Case/Package: 2020; Terminal Finish: Tin; Min Operating Temperature: -55°C; Max Operating Temperature: 125°C; Tolerance: 20%; JESD-609 Code: e3; Resistor Type: TRIMMER; Construction: Trimmer; Packaging: Tape and Reel; Technology: CERMET; Termination: Gull Wing; Working Voltage: 200V; Package Width: 5mm; RoHS Compliant: Yes; ComponentLink1URL: https://datasheet.ciiva.com:443/pdfs/VipMasterIC/IC/VISH/VISH-S-A0007084328/VISH-S-A0007084328-1.pdf?src-supplier=IHS+Markit; ComponentLink1Description: https://datasheet.ciiva.com:443/pdfs/VipMasterIC/IC/VISH/VISH-S-A0007084328/VISH-S-A0007084328-1.pdf?src-supplier=IHS+Markit; ComponentLink2URL: https://datasheet.ciiva.com/11831/0900766b80442f56-11831524.pdf?src-supplier=Rs; ComponentLink2Description: https://datasheet.ciiva.com/11831/0900766b80442f56-11831524.pdf?src-supplier=Rs; ComponentLink3URL: https://datasheet.ciiva.com/2157/ts53y-2157357.pdf?src-supplier=Digikey; ComponentLink3Description: https://datasheet.ciiva.com/2157/ts53y-2157357.pdf?src-supplier=Digikey; ComponentLink4URL: https://datasheet.ciiva.com/2157/ts53y-2157358.pdf?src-supplier=Digikey; ComponentLink4Description: https://datasheet.ciiva.com/2157/ts53y-2157358.pdf?src-supplier=Digikey; ComponentLink5URL: https://datasheet.ciiva.com/2157/ts53y-2157359.pdf?src-supplier=Digikey; ComponentLink5Description: https://datasheet.ciiva.com/2157/ts53y-2157359.pdf?src-supplier=Digikey; ComponentLink6URL: https://datasheet.ciiva.com/8697/ts53y-8697353.pdf?src-supplier=Avnet; ComponentLink6Description: https://datasheet.ciiva.com/8697/ts53y-8697353.pdf?src-supplier=Avnet; ComponentLink7URL: https://datasheet.ciiva.com/8021/1696501-8021149.pdf?src-supplier=Element14; ComponentLink7Description: https://datasheet.ciiva.com/8021/1696501-8021149.pdf?src-supplier=Element14; ComponentLink8URL: https://datasheet.ciiva.com/16354/ts53y-16354136.pdf?src-supplier=Future+Electronics; ComponentLink8Description: https://datasheet.ciiva.com/16354/ts53y-16354136.pdf?src-supplier=Future+Electronics; ComponentLink9URL: https://datasheet.ciiva.com/16717/70218802-16717320.pdf?src-supplier=Allied+Electronics; ComponentLink9Description: https://datasheet.ciiva.com/16717/70218802-16717320.pdf?src-supplier=Allied+Electronics
VR3 = TS53YL102MR10: Trimmer, Cermet, 0.25W, 1000ohm, 15.8V, 20% +/-Tol, 100ppm/Cel, 1 Turn(s); Manufacturer: Vishay; Actuator Orientation: Vertical; Actuator Type: SCREW; Number of Turns: 1; Power: 250mW; Rated Temperature: 70°C; Value: 1kR; Resistance Law: Linear; Rotational Angle: 220°; Temperature Coefficient (ppm/Cel): -100,100; Package Height: 2.7mm; Package Length: 5mm; Supplier: Mouser; Supplier Part Number: 72-TS53YL-1K; Manufacturer Part Number: TS53YL102MR10; RoHS: Yes; Category: Variable Resistors and Potentiometers; Stock: 1337; Pricing: 1=2.72, 10=2.29, 50=2.29, 100=1.93, 1000=1.56, 10000=1.42 (USD); Mounting Technology: Surface Mount; Pins: 3; Package Shape: Rectangular; Case/Package: 2020; Terminal Finish: Tin; Min Operating Temperature: -55°C; Max Operating Temperature: 125°C; Tolerance: 20%; JESD-609 Code: e3; Resistor Type: TRIMMER; Construction: Trimmer; Packaging: Tape and Reel; Technology: CERMET; Termination: Gull Wing; Working Voltage: 15.8V; Package Width: 5mm; Reach SVHC Compliant: Yes; RoHS Compliant: Yes; ComponentLink1URL: https://datasheet.ciiva.com:443/pdfs/VipMasterIC/IC/VISH/VISH-S-A0007084328/VISH-S-A0007084328-1.pdf?src-supplier=IHS+Markit; ComponentLink1Description: https://datasheet.ciiva.com:443/pdfs/VipMasterIC/IC/VISH/VISH-S-A0007084328/VISH-S-A0007084328-1.pdf?src-supplier=IHS+Markit; ComponentLink2URL: https://datasheet.ciiva.com/11831/0900766b80442f56-11831972.pdf?src-supplier=Rs; ComponentLink2Description: https://datasheet.ciiva.com/11831/0900766b80442f56-11831972.pdf?src-supplier=Rs; ComponentLink3URL: https://datasheet.ciiva.com/2158/ts53y-2158713.pdf?src-supplier=Digikey; ComponentLink3Description: https://datasheet.ciiva.com/2158/ts53y-2158713.pdf?src-supplier=Digikey; ComponentLink4URL: https://datasheet.ciiva.com/2158/ts53y-2158714.pdf?src-supplier=Digikey; ComponentLink4Description: https://datasheet.ciiva.com/2158/ts53y-2158714.pdf?src-supplier=Digikey; ComponentLink5URL: https://datasheet.ciiva.com/2158/ts53y-2158715.pdf?src-supplier=Digikey; ComponentLink5Description: https://datasheet.ciiva.com/2158/ts53y-2158715.pdf?src-supplier=Digikey; ComponentLink6URL: https://datasheet.ciiva.com/16335/ts53y-16335610.pdf?src-supplier=Future+Electronics; ComponentLink6Description: https://datasheet.ciiva.com/16335/ts53y-16335610.pdf?src-supplier=Future+Electronics; ComponentLink7URL: https://datasheet.ciiva.com/16716/70218802-16716971.pdf?src-supplier=Allied+Electronics; ComponentLink7Description: https://datasheet.ciiva.com/16716/70218802-16716971.pdf?src-supplier=Allied+Electronics; ComponentLink8URL: https://datasheet.ciiva.com/22715/1696501-22715039.pdf?src-supplier=Element14; ComponentLink8Description: https://datasheet.ciiva.com/22715/1696501-22715039.pdf?src-supplier=Element14